# Altium schematic sheet 07_LMS7002M_Power.SchDoc: LMS7002M power
size A3; Organization: Lime Microsystems; Address1: Surrey Tech Centre; Address2: Guildford GU2 7YG; Address3: Surrey; Address4: United Kingdom; Revision: v1.0; SheetNumber: 7; SheetTotal: 10
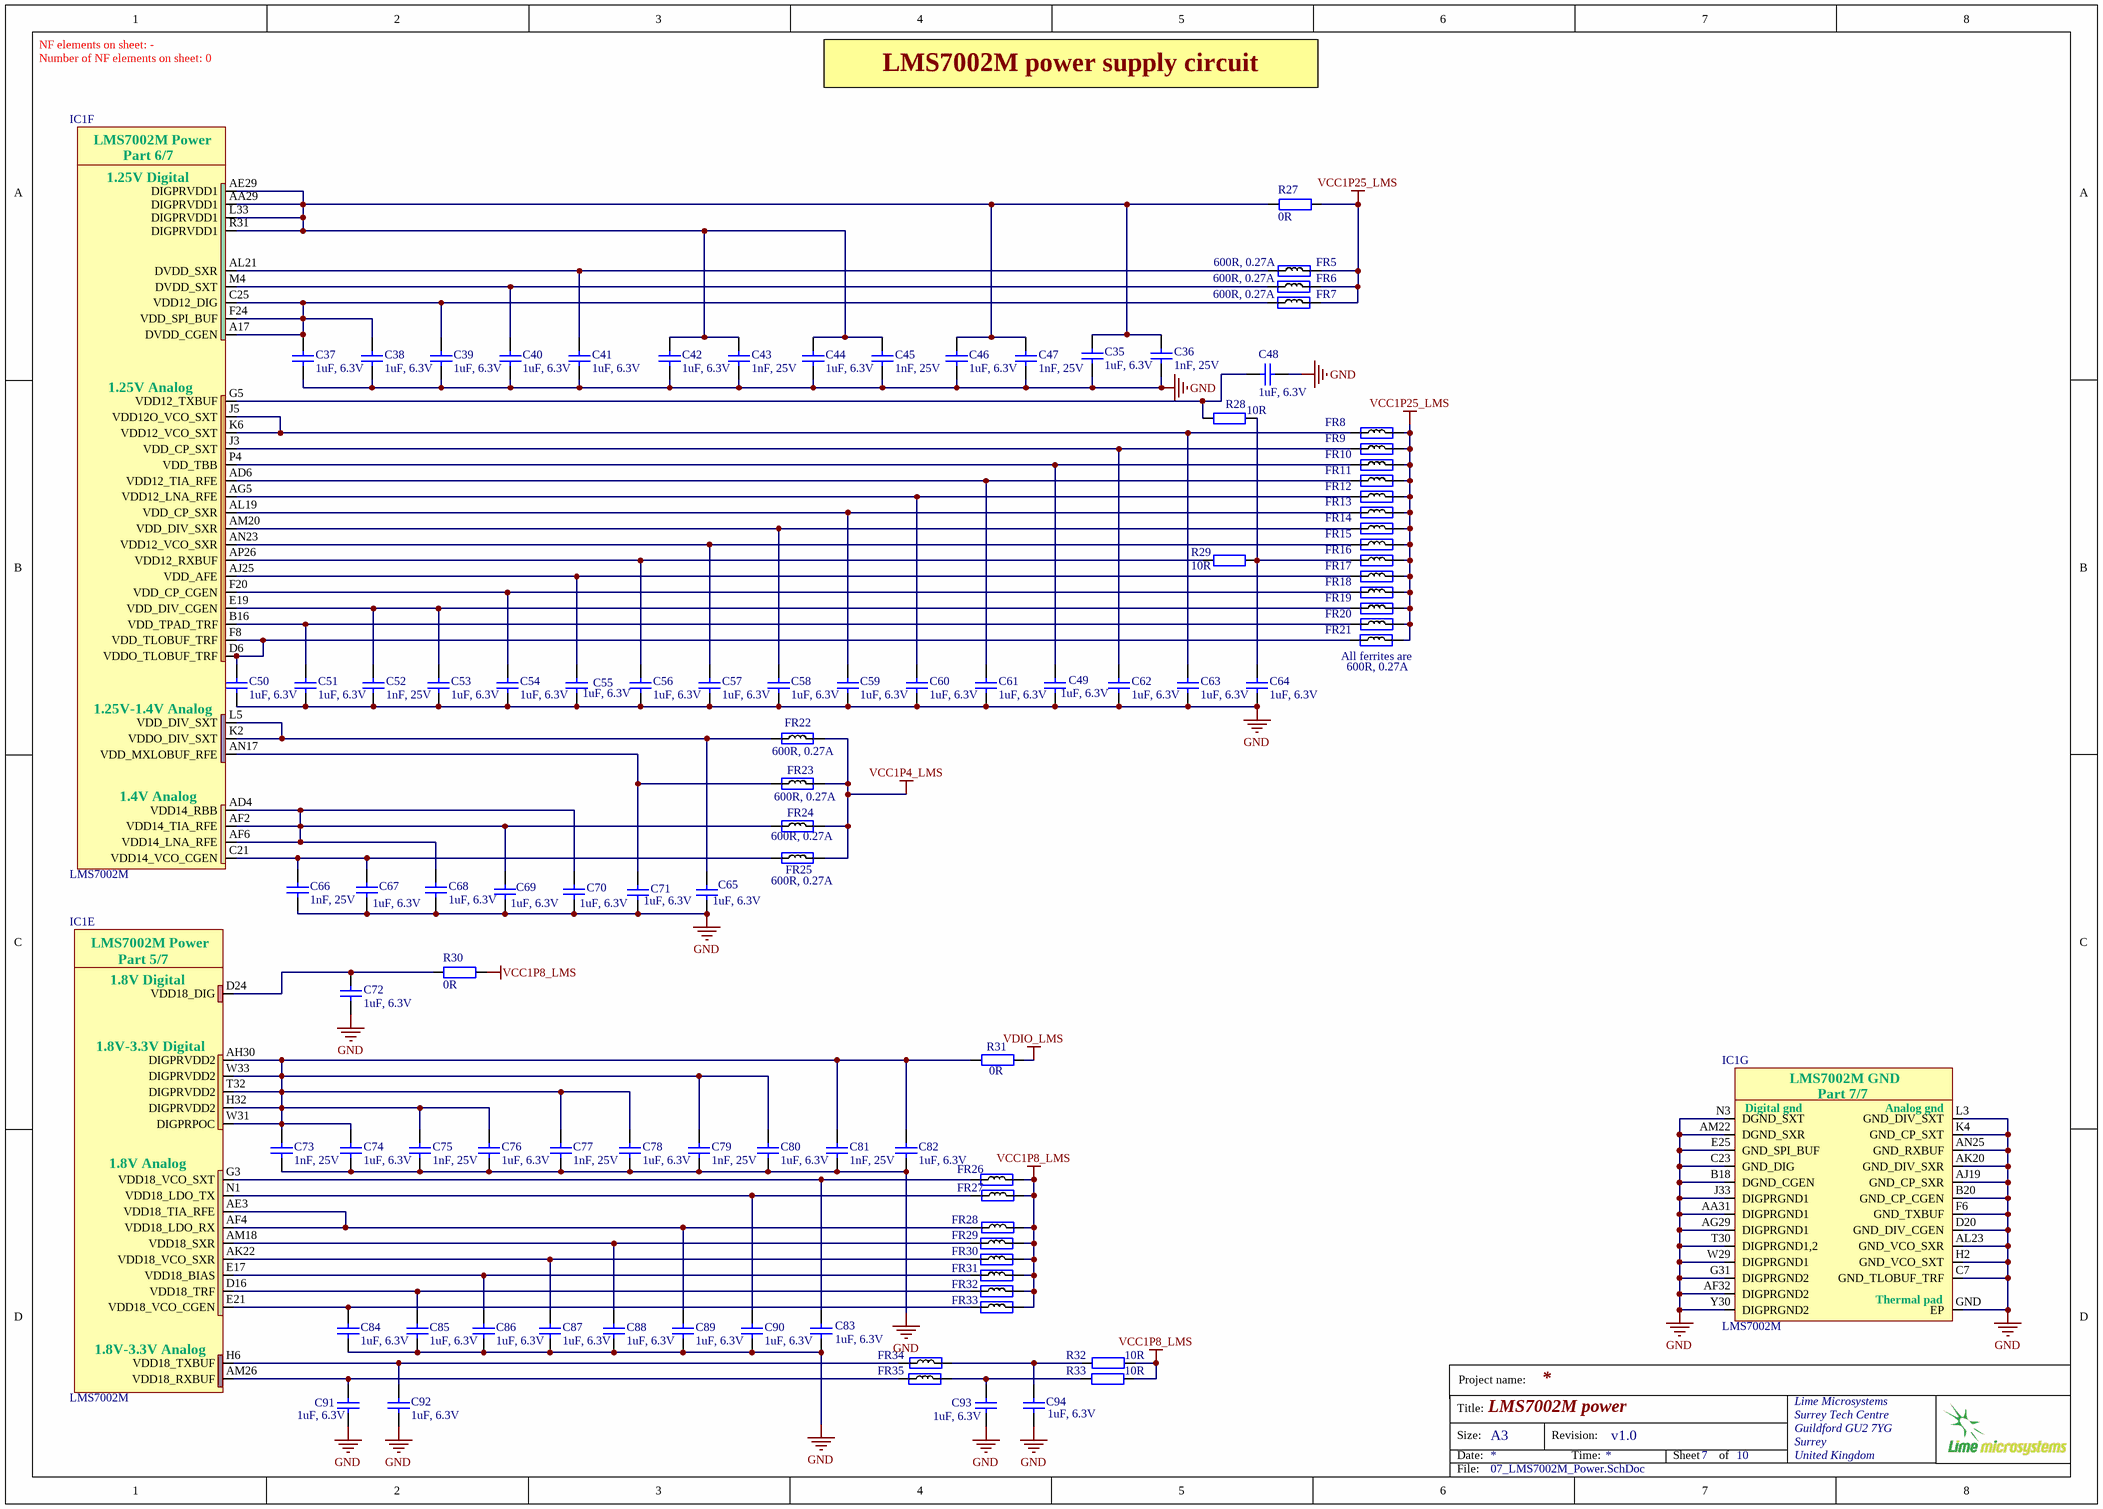
[diagram p0: 07_LMS7002M_Power.SchDoc]

## Parts
C35  1uF, 6.3V  [CAP0201]
C36  1nF, 25V  [CAP0201]
C37  1uF, 6.3V  [CAP0201]
C38  1uF, 6.3V  [CAP0201]
C39  1uF, 6.3V  [CAP0201]
C40  1uF, 6.3V  [CAP0201]
C41  1uF, 6.3V  [CAP0201]
C42  1uF, 6.3V  [CAP0201]
C43  1nF, 25V  [CAP0201]
C44  1uF, 6.3V  [CAP0201]
C45  1nF, 25V  [CAP0201]
C46  1uF, 6.3V  [CAP0201]
C47  1nF, 25V  [CAP0201]
C48  1uF, 6.3V  [CAP0201]
C49  1uF, 6.3V  [CAP0201]
C50  1uF, 6.3V  [CAP0201]
C51  1uF, 6.3V  [CAP0201]
C52  1nF, 25V  [CAP0201]
C53  1uF, 6.3V  [CAP0201]
C54  1uF, 6.3V  [CAP0201]
C55  1uF, 6.3V  [CAP0201]
C56  1uF, 6.3V  [CAP0201]
C57  1uF, 6.3V  [CAP0201]
C58  1uF, 6.3V  [CAP0201]
C59  1uF, 6.3V  [CAP0201]
C60  1uF, 6.3V  [CAP0201]
C61  1uF, 6.3V  [CAP0201]
C62  1uF, 6.3V  [CAP0201]
C63  1uF, 6.3V  [CAP0201]
C64  1uF, 6.3V  [CAP0201]
C65  1uF, 6.3V  [CAP0201]
C66  1nF, 25V  [CAP0201]
C67  1uF, 6.3V  [CAP0201]
C68  1uF, 6.3V  [CAP0201]
C69  1uF, 6.3V  [CAP0201]
C70  1uF, 6.3V  [CAP0201]
C71  1uF, 6.3V  [CAP0201]
C72  1uF, 6.3V  [CAP0201]
C73  1nF, 25V  [CAP0201]
C74  1uF, 6.3V  [CAP0201]
C75  1nF, 25V  [CAP0201]
C76  1uF, 6.3V  [CAP0201]
C77  1nF, 25V  [CAP0201]
C78  1uF, 6.3V  [CAP0201]
C79  1nF, 25V  [CAP0201]
C80  1uF, 6.3V  [CAP0201]
C81  1nF, 25V  [CAP0201]
C82  1uF, 6.3V  [CAP0201]
C83  1uF, 6.3V  [CAP0201]
C84  1uF, 6.3V  [CAP0201]
C85  1uF, 6.3V  [CAP0201]
C86  1uF, 6.3V  [CAP0201]
C87  1uF, 6.3V  [CAP0201]
C88  1uF, 6.3V  [CAP0201]
C89  1uF, 6.3V  [CAP0201]
C90  1uF, 6.3V  [CAP0201]
C91  1uF, 6.3V  [CAP0201]
C92  1uF, 6.3V  [CAP0201]
C93  1uF, 6.3V  [CAP0201]
C94  1uF, 6.3V  [CAP0201]
FR5  600R, 0.27A  [RES0201]
FR6  600R, 0.27A  [RES0201]
FR7  600R, 0.27A  [RES0201]
FR8  600R, 0.27A  [RES0201]
FR9  600R, 0.27A  [RES0201]  (value not drawn)
FR10  600R, 0.27A  [RES0201]  (value not drawn)
FR11  600R, 0.27A  [RES0201]  (value not drawn)
FR12  600R, 0.27A  [RES0201]  (value not drawn)
FR13  600R, 0.27A  [RES0201]  (value not drawn)
FR14  600R, 0.27A  [RES0201]  (value not drawn)
FR15  600R, 0.27A  [RES0201]  (value not drawn)
FR16  600R, 0.27A  [RES0201]  (value not drawn)
FR17  600R, 0.27A  [RES0201]  (value not drawn)
FR18  600R, 0.27A  [RES0201]  (value not drawn)
FR19  600R, 0.27A  [RES0201]  (value not drawn)
FR20  600R, 0.27A  [RES0201]  (value not drawn)
FR21  600R, 0.27A  [RES0201]  (value not drawn)
FR22  600R, 0.27A  [RES0201]
FR23  600R, 0.27A  [RES0201]
FR24  600R, 0.27A  [RES0201]
FR25  600R, 0.27A  [RES0201]
FR26  600R, 0.27A  [RES0201]  (value not drawn)
FR27  600R, 0.27A  [RES0201]  (value not drawn)
FR28  600R, 0.27A  [RES0201]  (value not drawn)
FR29  600R, 0.27A  [RES0201]  (value not drawn)
FR30  600R, 0.27A  [RES0201]  (value not drawn)
FR31  600R, 0.27A  [RES0201]  (value not drawn)
FR32  600R, 0.27A  [RES0201]  (value not drawn)
FR33  600R, 0.27A  [RES0201]  (value not drawn)
FR34  600R, 0.27A  [RES0201]  (value not drawn)
FR35  600R, 0.27A  [RES0201]  (value not drawn)
IC1  LMS7002M  [LMS7002M_v5_LESS_SILK]  (parts E,F,G of 7)
R27  0R  [RES0402]
R28  10R  [RES0201]
R29  10R  [RES0201]
R30  0R  [RES0201]
R31  0R  [RES0402]
R32  10R  [RES0201]
R33  10R  [RES0201]

## Nets
GND: C35.2 C36.2 C37.2 C38.2 C39.2 C40.1 C41.2 C42.2 C43.2 C44.2 C45.2 C46.2 C47.2 C48.2 C49.2 C50.2 C51.2 C52.2 C53.2 C54.1 C55.2 C56.2 C57.2 C58.2 C59.2 C60.2 C61.1 C62.2 C63.1 C64.1 C65.2 C66.2 C67.2 C68.2 C69.2 C70.2 C71.2 C72.2 C73.2 C74.2 C75.2 C76.2 C77.2 C78.2 C79.2 C80.2 C81.2 C82.2 C83.2 C84.2 C85.2 C86.2 C87.2 C88.2 C89.2 C90.2 C91.2 C92.2 C93.2 C94.2 IC1.AA31(DIGPRGND1) IC1.AF32(DIGPRGND2) IC1.AG29(DIGPRGND1) IC1.AJ19(GND_CP_SXR) IC1.AK20(GND_DIV_SXR) IC1.AL23(GND_VCO_SXR) IC1.AM22(DGND_SXR) IC1.AN25(GND_RXBUF) IC1.B18(DGND_CGEN) IC1.B20(GND_CP_CGEN) IC1.C7(GND_TLOBUF_TRF) IC1.C23(GND_DIG) IC1.D20(GND_DIV_CGEN) IC1.E25(GND_SPI_BUF) IC1.F6(GND_TXBUF) IC1.G31(DIGPRGND2) IC1.GND(EP) IC1.H2(GND_VCO_SXT) IC1.J33(DIGPRGND1) IC1.K4(GND_CP_SXT) IC1.L3(GND_DIV_SXT) IC1.N3(DGND_SXT) IC1.T30(DIGPRGND1,2) IC1.W29(DIGPRGND1) IC1.Y30(DIGPRGND2)
VCC1P4_LMS: FR22.2 FR23.2 FR24.2 FR25.2
VCC1P8_LMS: FR26.2 FR27.1 FR28.1 FR29.2 FR30.2 FR31.2 FR32.2 FR33.2 R30.2 R32.2 R33.1
VCC1P25_LMS: FR5.2 FR6.2 FR7.2 FR8.2 FR9.2 FR10.2 FR11.2 FR12.2 FR13.2 FR14.2 FR15.2 FR16.2 FR17.2 FR18.2 FR19.2 FR20.2 FR21.2 R27.1
VDIO_LMS: R31.1
NetC35_1: C35.1 C36.1 C42.1 C43.1 C44.1 C45.1 C46.1 C47.1 IC1.AA29(DIGPRVDD1) IC1.AE29(DIGPRVDD1) IC1.L33(DIGPRVDD1) IC1.R31(DIGPRVDD1) R27.2
NetC37_1: C37.1 C38.1 C39.1 FR7.1 IC1.A17(DVDD_CGEN) IC1.C25(VDD12_DIG) IC1.F24(VDD_SPI_BUF)
NetC40_2: C40.2 FR6.1 IC1.M4(DVDD_SXT)
NetC41_1: C41.1 FR5.1 IC1.AL21(DVDD_SXR)
NetC48_1: C48.1 IC1.G5(VDD12_TXBUF) R28.1
NetC49_1: C49.1 FR10.1 IC1.P4(VDD_TBB)
NetC50_1: C50.1 FR21.1 IC1.D6(VDDO_TLOBUF_TRF) IC1.F8(VDD_TLOBUF_TRF)
NetC51_1: C51.1 FR20.1 IC1.B16(VDD_TPAD_TRF)
NetC52_1: C52.1 C53.1 FR19.1 IC1.E19(VDD_DIV_CGEN)
NetC54_2: C54.2 FR18.1 IC1.F20(VDD_CP_CGEN)
NetC55_1: C55.1 FR17.1 IC1.AJ25(VDD_AFE)
NetC56_1: C56.1 IC1.AP26(VDD12_RXBUF) R29.1
NetC57_1: C57.1 FR15.1 IC1.AN23(VDD12_VCO_SXR)
NetC58_1: C58.1 FR14.1 IC1.AM20(VDD_DIV_SXR)
NetC59_1: C59.1 FR13.1 IC1.AL19(VDD_CP_SXR)
NetC60_1: C60.1 FR12.1 IC1.AG5(VDD12_LNA_RFE)
NetC61_2: C61.2 FR11.1 IC1.AD6(VDD12_TIA_RFE)
NetC62_1: C62.1 FR9.1 IC1.J3(VDD_CP_SXT)
NetC63_2: C63.2 FR8.1 IC1.J5(VDD12O_VCO_SXT) IC1.K6(VDD12_VCO_SXT)
NetC64_2: C64.2 FR16.1 R28.2 R29.2
NetC65_1: C65.1 FR22.1 IC1.K2(VDDO_DIV_SXT) IC1.L5(VDD_DIV_SXT)
NetC66_1: C66.1 C67.1 FR25.1 IC1.C21(VDD14_VCO_CGEN)
NetC68_1: C68.1 C69.1 C70.1 FR24.1 IC1.AD4(VDD14_RBB) IC1.AF2(VDD14_TIA_RFE) IC1.AF6(VDD14_LNA_RFE)
NetC71_1: C71.1 FR23.1 IC1.AN17(VDD_MXLOBUF_RFE)
NetC72_1: C72.1 IC1.D24(VDD18_DIG) R30.1
NetC73_1: C73.1 C74.1 C75.1 C76.1 C77.1 C78.1 C79.1 C80.1 C81.1 C82.1 IC1.AH30(DIGPRVDD2) IC1.H32(DIGPRVDD2) IC1.T32(DIGPRVDD2) IC1.W31(DIGPRPOC) IC1.W33(DIGPRVDD2) R31.2
NetC83_1: C83.1 FR26.1 IC1.G3(VDD18_VCO_SXT)
NetC84_1: C84.1 FR33.1 IC1.E21(VDD18_VCO_CGEN)
NetC85_1: C85.1 FR32.1 IC1.D16(VDD18_TRF)
NetC86_1: C86.1 FR31.1 IC1.E17(VDD18_BIAS)
NetC87_1: C87.1 FR30.1 IC1.AK22(VDD18_VCO_SXR)
NetC88_1: C88.1 FR29.1 IC1.AM18(VDD18_SXR)
NetC89_1: C89.1 FR28.2 IC1.AE3(VDD18_TIA_RFE) IC1.AF4(VDD18_LDO_RX)
NetC90_1: C90.1 FR27.2 IC1.N1(VDD18_LDO_TX)
NetC91_1: C91.1 FR35.1 IC1.AM26(VDD18_RXBUF)
NetC92_1: C92.1 FR34.2 IC1.H6(VDD18_TXBUF)
NetC93_1: C93.1 FR35.2 R33.2
NetC94_1: C94.1 FR34.1 R32.1

## Notes on the sheet
- NF elements on sheet: -
- Number of NF elements on sheet: 0
- LMS7002M power supply circuit
- (near FR21) All ferrites are
- Project name:
- Title:
- Size:
- Date:
- A3
- Revision:
- Time:
- Sheet
- of
- File:
- (in symbol LMS7002Mr4, part E) LMS7002M Power; Part 5/7; 1.8V Digital; 1.8V-3.3V Digital; 1.8V Analog; 1.8V-3.3V Analog
- (in symbol LMS7002Mr4, part F) LMS7002M Power; Part 6/7; 1.25V Digital; 1.25V Analog; 1.25V-1.4V Analog; 1.4V Analog
- (in symbol LMS7002Mr4, part G) LMS7002M GND; Part 7/7; Digital gnd; Analog gnd; Thermal pad

## Library data of the parts
C35 C37-C42 C44 C46 C48-C51 C53-C65 C67-C72 C74 C76 C78 C80 C82-C94 = Cap_0402: Manufacturer: TDK Corporation; Manufacturer Part Number 1: JMK063ABJ105MP-F; Part Description: 1µF ±20% 6.3V X5R Ceramic Capacitor -55°C ~ 85°C Surface Mount, MLCC 0201 (0603 Metric) 0.024" L x 0.012" W (0.60mm x 0.30mm); Value: 1uF, 20%; Tolerance: ±20%; Capacitance: 1.0µF; Temperature Coefficient: X5R; Supplier 1: Digi-Key; Supplier Part Number 1: 587-5864-2-ND; Applications: General Purpose; Features: -; Lead Style: -; Ratings: -; Thickness (Max): -; Lead Spacing: -; Height - Seated (Max): -; Size / Dimension: 0.024" L x 0.012" W (0.60mm x 0.30mm); Mounting Type: Surface Mount, MLCC; Operating Temperature: -55°C ~ 85°C; Package / Case: 0201 (0603 Metric); Packaging: Cut Tape (CT); Voltage - Rated: 6.3V; Category: Capacitors; RoHS: RoHS Compliant
C36 C43 C45 C47 C52 C66 C73 C75 C77 C79 C81 = Cap_0402: Manufacturer Part Number 1: C0603X7R1E102K030BA; Manufacturer: TDK Corporation; Part Description: 1000pF ±10% 25V X7R Ceramic Capacitor -55°C ~ 125°C Surface Mount, MLCC 0201 (0603 Metric) 0.024" L x 0.012" W (0.60mm x 0.30mm); Temperature Coefficient: X7R; Tolerance: ±10%; Capacitance: 1000pF; Value: 1nF, 25V; Supplier 1: Digi-Key; Supplier Part Number 1: 445-7275-1-ND; Voltage - Rated: 25V; Features: -; Package / Case: 0201 (0603 Metric); Lead Spacing: -; Mounting Type: Surface Mount, MLCC; Lead Style: -; Height - Seated (Max): -; Operating Temperature: -55°C ~ 125°C; Size / Dimension: 0.024" L x 0.012" W (0.60mm x 0.30mm); Applications: General Purpose; Ratings: -; Thickness (Max): 0.013" (0.33mm); RoHS: RoHS Compliant; Packaging: Cut Tape (CT); Category: Capacitors
FR5-FR35 = Ferrite: Manufacturer Part Number 1: BK0603TS601-T; Manufacturer: Taiyo Yuden; Part Description: FERRITE BEAD 600 OHM 0201 1LN; DC Resistance (DCR): 750 mOhm Max; Filter Type: Differential Mode - Single; Impedance @ Frequency: 600 Ohm @ 100MHz; Current Rating: 270mA; Value: 600R@100MHz; Supplier 1: Digi-Key; Supplier Part Number 1: 587-3277-1-ND; Size / Dimension: 0.024" L x 0.012" W (0.60mm x 0.30mm); Package / Case: 0201 (0603 Metric); Height (Max): 0.013" (0.33mm); Mounting Type: Surface Mount; Packaging: Cut Tape (CT); RoHS: RoHS Compliant; Category: Filters
IC1 = LMS7002Mr4: Schematic symbol revision 4. Default footprint - 0.31mm pad; Manufacturer: Lime Microsystems; Part Description: IC FPRF Transceiver LMS7002M; 261 pin aQFN; Supplier 1: Lime Microsystems; Supplier Part Number 1: LMS7002M; Manufacturer Part Number 1: LMS7002M
R27 R31 = Res_0402: Manufacturer Part Number 1: RC0402JR-070RL; Manufacturer: Yageo; Part Description: RES SMD 0.0OHM JUMPER 1/16W 0402; Resistance (Ohms): 0.0; Tolerance: Jumper; Power (Watts): 0.063W, 1/16W; Value: 0R; Supplier 1: Digi-Key; Supplier Part Number 1: 311-0.0JRTR-ND; Category: Resistors; Temperature Coefficient: -; Features: Moisture Resistant; Supplier Device Package: 0402; Height: 0.016" (0.40mm); Package / Case: 0402 (1005 Metric); Operating Temperature: -55°C ~ 155°C; Size / Dimension: 0.039" L x 0.020" W (1.00mm x 0.50mm); Composition: Thick Film; Packaging: Tape & Reel (TR); Number of Terminations: 2; RoHS: RoHS Compliant
R28 R29 R32 R33 = Res_0402: Manufacturer: Panasonic Electronic Components; Part Description: RES SMD 10 OHM 1% 1/20W 0201; Manufacturer Part Number 1: ERJ-1GEF10R0C; Power (Watts): 0.05W, 1/20W; Resistance (Ohms): 10; Tolerance: ±1%; Temperature Coefficient: ±200ppm/°C; Value: 10R; Supplier 1: Digi-Key; Supplier Part Number 1: P10.0ABCT-ND; Package / Case: 0201 (0603 Metric); Height: 0.010" (0.26mm); Supplier Device Package: 0201; Packaging: Cut Tape (CT); Composition: Thick Film; Category: Resistors; Number of Terminations: 2; Size / Dimension: 0.024" L x 0.012" W (0.60mm x 0.30mm); Operating Temperature: -55°C ~ 125°C; Features: -; RoHS: RoHS Compliant
R30 = Res_0402: Manufacturer: Yageo; Part Description: 0 Ohms Jumper Chip Resistor 0201 (0603 Metric) Moisture Resistant Thick Film; Manufacturer Part Number 1: RC0201JR-070RL; Tolerance: 5%; Max Power Dissipation: 50mW; Voltage Rating (DC): 25V; Value: 0R; Supplier 1: Digi-Key; Supplier Part Number 1: 311-0.0NCT-ND; Number of Terminations: 2; Height: 0.01inch; Features: Moisture Resistant; RoHS: Yes; Packaging: Tape and Reel; Case/Package: 0201; Case Code (Imperial): 0201; Case Code (Metric): 0603; ComponentLink1Description: http://www.yageo.com/documents/recent/PYu-RC_Group_51_RoHS_L_7.pdf; ComponentLink1URL: http://www.yageo.com/documents/recent/PYu-RC_Group_51_RoHS_L_7.pdf; ComponentLink2Description: https://datasheet.ciiva.com/7672/1563626-7672248.pdf?src-supplier=Element14; ComponentLink2URL: https://datasheet.ciiva.com/7672/1563626-7672248.pdf?src-supplier=Element14; ComponentLink3Description: https://datasheet.ciiva.com/7672/1563626-7672247.pdf?src-supplier=Element14; ComponentLink3URL: https://datasheet.ciiva.com/7672/1563626-7672247.pdf?src-supplier=Element14; ComponentLink4Description: https://datasheet.ciiva.com/7660/1421516-7660808.pdf?src-supplier=Element14; ComponentLink4URL: https://datasheet.ciiva.com/7660/1421516-7660808.pdf?src-supplier=Element14; ComponentLink5Description: https://datasheet.ciiva.com/46391/1421516-46391340.pdf?src-supplier=Element14; ComponentLink5URL: https://datasheet.ciiva.com/46391/1421516-46391340.pdf?src-supplier=Element14; Construction: Rectangular; Contact Plating: Tin,Matte; Depth: 0.3mm; Lead Free: Lead Free; Length: 0.024inch; Max Operating Temperature: 125°C; Military Standard: Not; Min Operating Temperature: -55°C; Package Quantity: 1; Power Rating: 50mW; Pricing 1: 1=0,10000, 10=0,03700, 25=0,02680, 50=0,02020, 100=0,01500, 250=0,01140, 500=0,00912, 1000=0,00672, 5000=0,00482 (USD); Radiation Hardening: No; Resistance: 0R; Resistance Tolerance: 5%; Resistor Type: Thick Film; RoHS Compliant: Yes; Series: RC; Size Code: 0201; Stock 1: 6252381; Termination: SMD/SMT; Voltage Rating: 25V; Weight: 6E-06oz; Width: 0.012inch